# EAGLE design button_brick_smd (EAGLE 7.2.0)
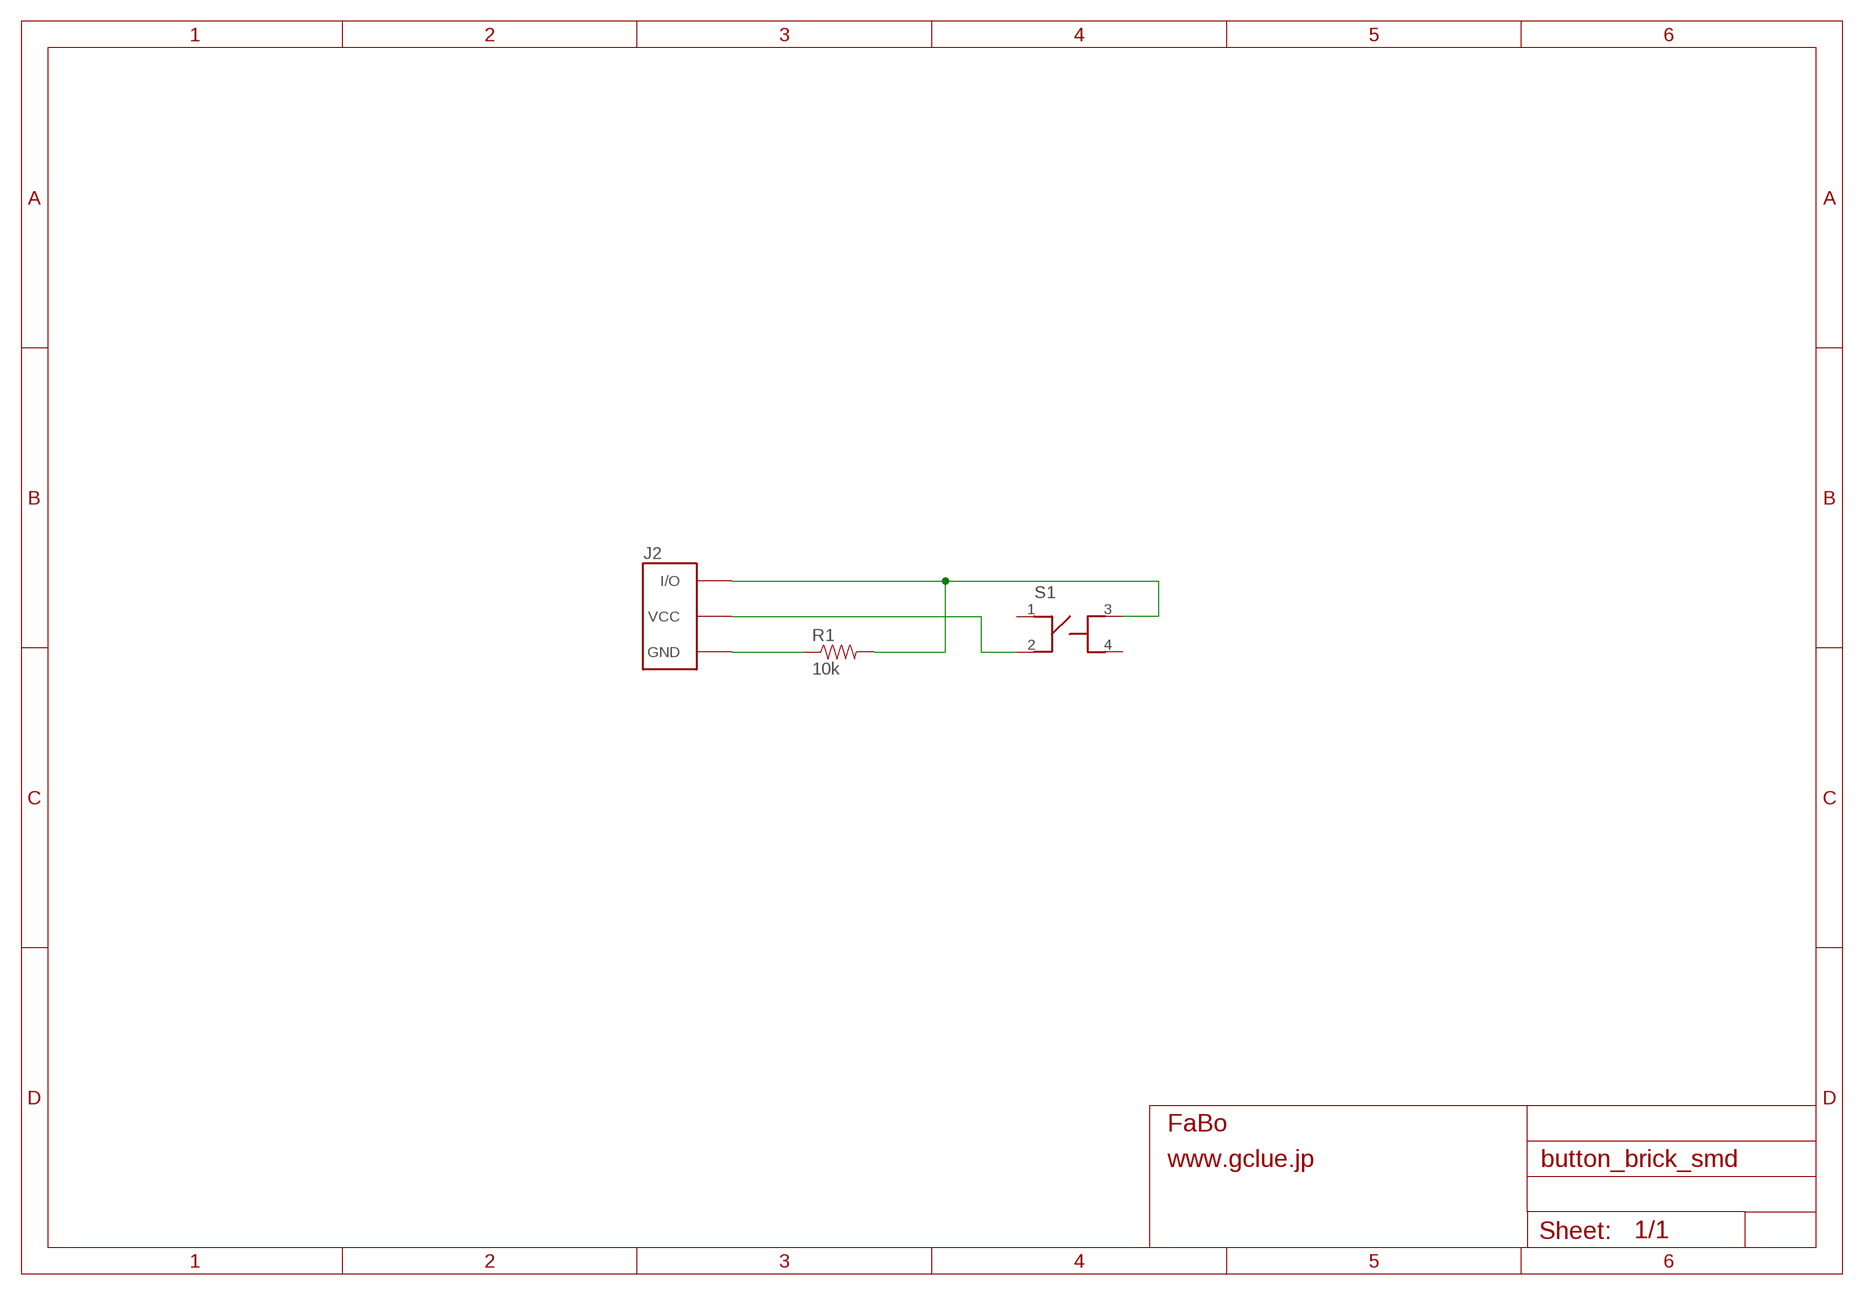
[diagram p0: schematic, sheet 1]

## Parts
J2  BRICK_3PIN  [BRICK_3PIN]
R1  10k  RESISTOR0603  [0603-RES]
S1  SWITCH-LS6J2M-T  [SWITCH-LS6J2M-T]

## Nets
GND: J2.GND R1.1
N$1: J2.VCC S1.2
N$3: J2.IN/OUT(I/O) R1.2 S1.3
Unconnected: S1.1 S1.4

## Library data of the parts
J2 = gclue:BRICK_3PIN: FaBo Brick 3pin
R1 = SparkFun-Resistors:RESISTOR: Resistor Basic schematic elements and footprints for 0603, 1206, and PTH resistors.
S1 = gclue:SWITCH-LS6J2M-T: Switch Tact SMD(LS6J2M-T)

## Board
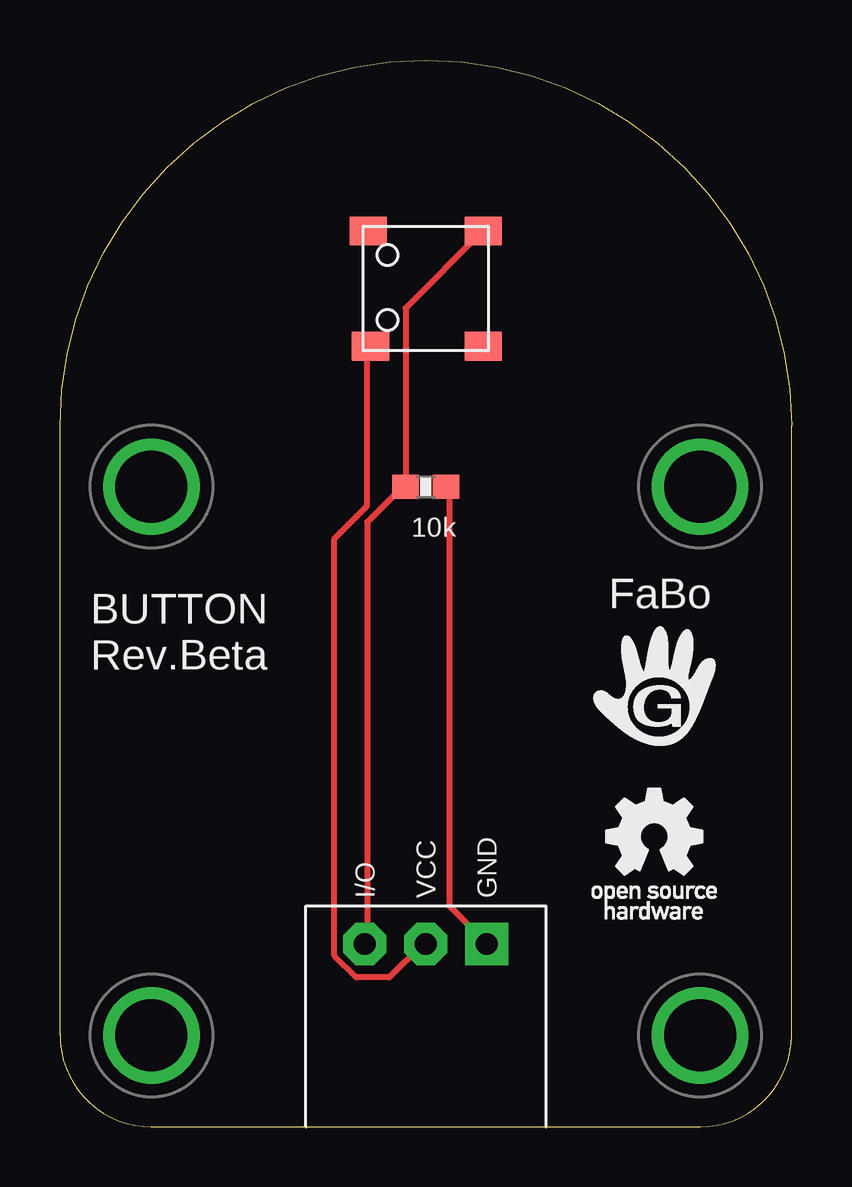
[diagram p1: board, top side]
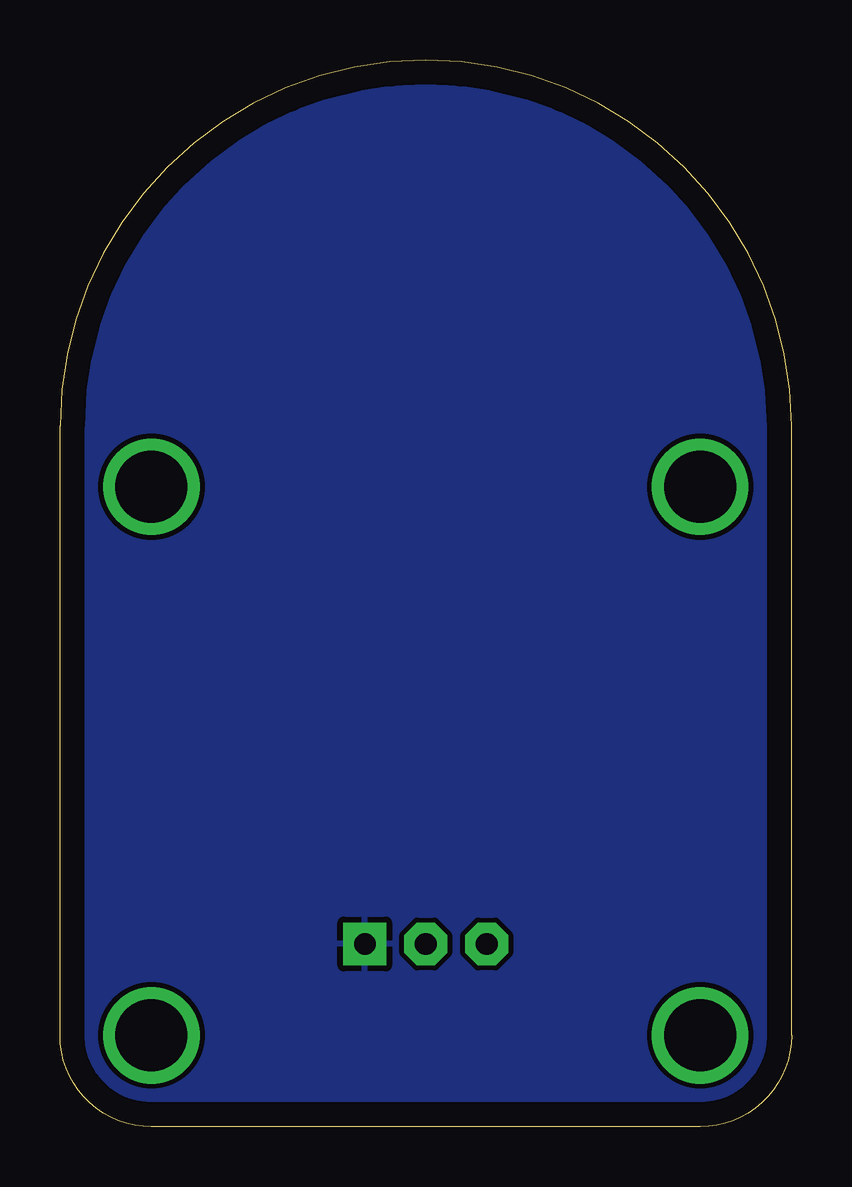
[diagram p2: board, bottom side, seen from below]

Size 30.48 x 44.45 mm. Coordinates in mm from the lower left corner, seen from the top.
Copper layers (1*16): Top 0.035mm / dielectric 1.5mm / Bottom 0.035mm
Design rules "default": minimum track width 10mil, minimum drill 24mil, track to track 8mil, track to pad 8mil, pad to pad 8mil, via to via 8mil, smd to smd 8mil, copper to edge 40mil, drill to drill 8mil, minimum pad ring 10mil, minimum via ring 8mil, stop-mask expansion 4mil, vias tented up to drill 0mil, thermal gap 10mil

### Footprints (pad centres in the part's own frame; a part is rotated, then mirrored left to right if it is on the bottom)
BRICK_3PIN = drill 0.9 pad 1.778 square: GND 2.54,-11.43 | drill 0.9 pad 1.778 octagon: IN/OUT -2.54,-11.43; VCC 0,-11.43 | drill 3 pad 3.81: P$1 -11.43,7.62; P$2 11.43,7.62; P$3 11.43,-15.24; P$4 -11.43,-15.24
0603-RES = smd 1.1 x 1: 1 -0.85,0; 2 0.85,0
SWITCH-LS6J2M-T = smd 1.55 x 1.2: 1 -2.4,2.4; 2 -2.3,-2.4; 3 2.4,2.4; 4 2.4,-2.4

### Placement (x,y rotation side)
J2  15.24,19.05 0 top
R1  15.24,26.67 180 top
S1  15.24,34.93 0 top
U$1  [LOGO_GCLUE_M]  24.77,18.42 0 top
U$2  [LOGO_OSHW_T_M]  24.77,12.07 0 top

### Tracks (layer width: path | path; a pad name or v marks a point on that pad's centre or on a via)
GND
  Top 0.254: R1.1 16.23,26.57 16.23,9.2 17.6,7.82 J2.GND
  pour Bottom: 0,-0.63 30.48,-0.63 30.48,45.09 0,45.09
N$1
  Top 0.254: S1.2 12.8,32.51 12.8,25.88 11.43,24.51 11.43,7.14 12.34,6.22 13.72,6.22 15.09,7.6 J2.VCC
N$3
  Top 0.254: S1.3 17.6,37.31 14.4,34.11 14.4,26.8 R1.2 14.17,26.57 12.8,25.2 12.8,7.82 J2.IN/OUT

### Text on the board
tPlace: FaBo | BUTTON / Rev.Beta